# Altium schematic sheet power.SchDoc
size A4; SheetNumber: 3; SheetTotal: 4
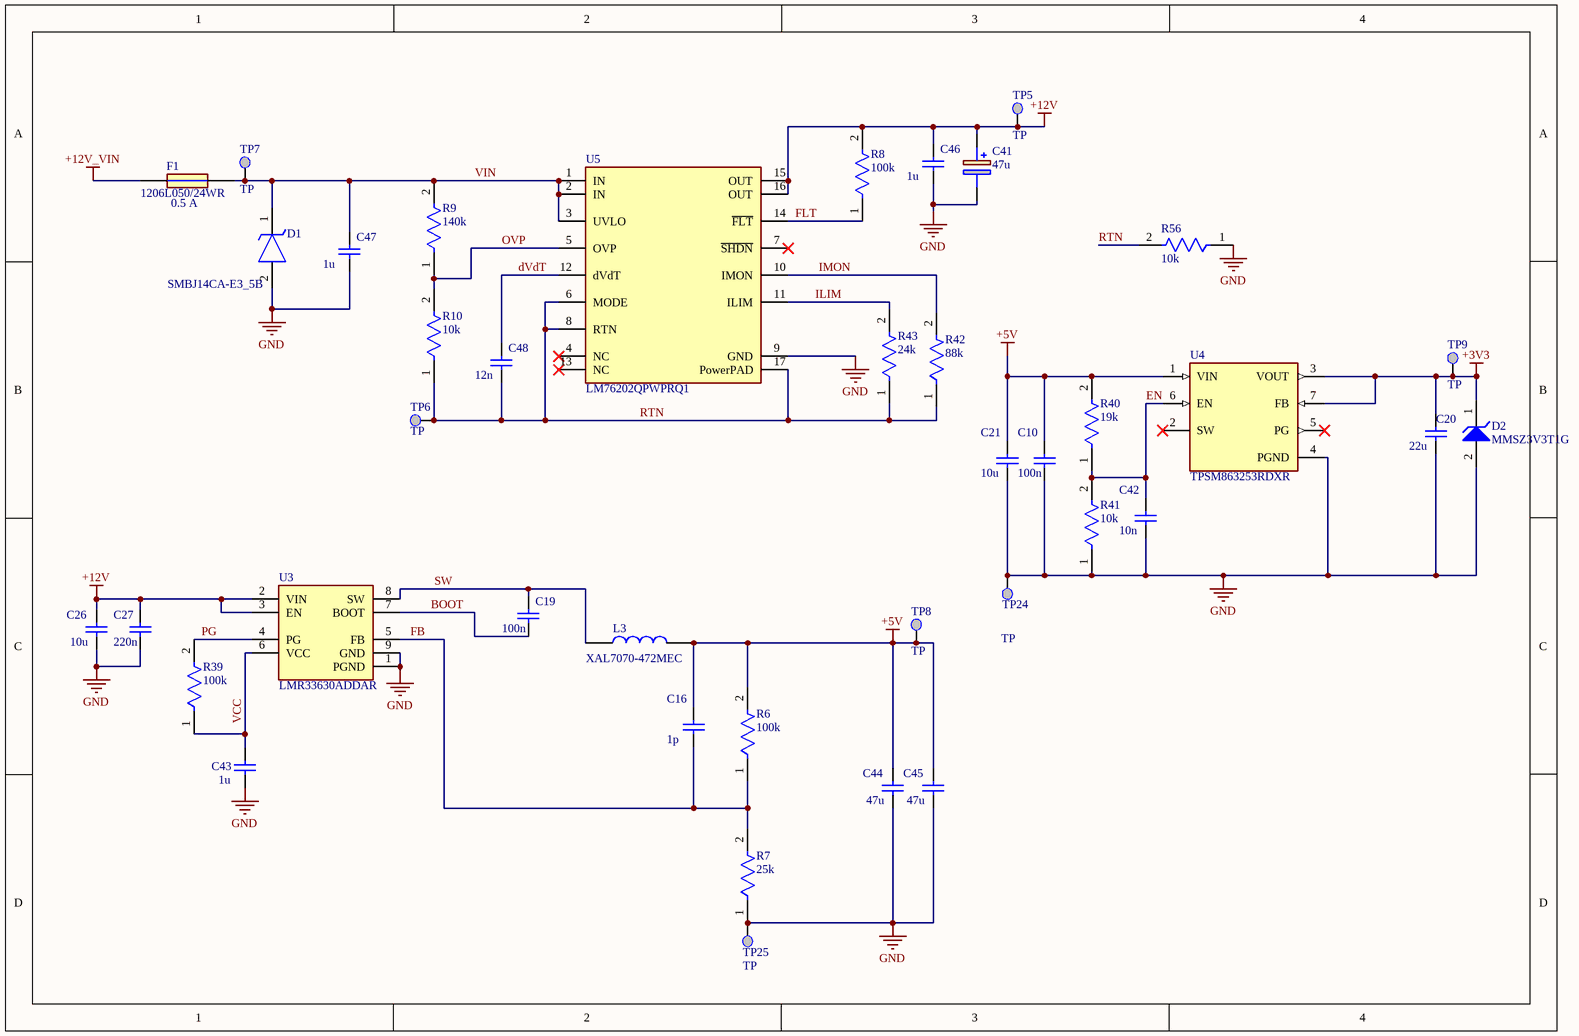
[diagram p0: power.SchDoc]

## Parts
C10  100n  [CAPC1206(3216)150_L]
C16  1p  [CAPC1206(3216)150_L]
C19  100n  [CAPC1206(3216)150_L]
C20  22u  [CAPC1206(3216)150_L]
C21  10u  [CAPC1206(3216)150_L]
C26  10u  [CAPC1206(3216)150_L]
C27  220n  [CAPC1206(3216)150_L]
C41  47u  [EDK476M035S9GAA]
C42  10n  [CAPC1206(3216)150_L]
C43  1u  [CAPC1206(3216)150_L]
C44  47u  [CAPC1206(3216)150_L]
C45  47u  [CAPC1206(3216)150_L]
C46  1u  [CAPC1206(3216)150_L]
C47  1u  [CAPC1206(3216)150_L]
C48  12n  [CAPC1206(3216)150_L]
D1  SMBJ14CA-E3_5B  [SMBJ13A-E3_5B]
D2  MMSZ3V3T1G  [ONSC-SOD-123-2-425-04_V]
F1  1206L050/24WR  [0ZCJ0025FF2E]
L3  XAL7070-472MEC  [XAL7070472MEC]
R6  100k  [FP-RK73H2B-MFG]
R7  25k  [FP-RK73H2B-MFG]
R8  100k  [FP-RK73H2B-MFG]
R9  140k  [FP-RK73H2B-MFG]
R10  10k  [FP-RK73H2B-MFG]
R39  100k  [FP-RK73H2B-MFG]
R40  19k  [FP-RK73H2B-MFG]
R41  10k  [FP-RK73H2B-MFG]
R42  88k  [FP-RK73H2B-MFG]
R43  24k  [FP-RK73H2B-MFG]
R56  10k  [FP-RK73H2B-MFG]
TP5  TP  [Test_Point]
TP6  TP  [Test_Point]
TP7  TP  [Test_Point]
TP8  TP  [Test_Point]
TP9  TP  [Test_Point]
TP24  TP  [Test_Point]
TP25  TP  [Test_Point]
U3  LMR33630ADDAR  [LMR33630ADDAR]
U4  TPSM863253RDXR  [TPSM863253RDXR]
U5  LM76202QPWPRQ1  [FP-PWP0016H-MFG]

## Nets
+3V3: C20.1 D2.1(K) TP9.1 U4.3(VOUT) U4.7(FB)
+5V: C10.1 C16.1 C21.1 C44.1 C45.1 L3.2 R6.2 R40.2 TP8.1 U4.1(VIN)
+12V: C26.1 C27.1 C41.1(+) C46.1 R8.2 TP5.1 U3.2(VIN) U3.3(EN) U5.15(OUT) U5.16(OUT)
+12V_VIN: F1.1
GND: C10.2 C20.2 C21.2 C26.2 C27.2 C41.2(-) C42.2 C43.2 C44.2 C45.2 C46.2 C47.2 D1.2(A) D2.2(A) R7.1 R41.1 R56.1 TP24.1 TP25.1 U3.1(PGND) U3.9(GND) U4.4(PGND) U5.9(GND)
BOOT: C19.2 U3.7(BOOT)
dVdT: C48.1 U5.12(dVdT)
EN: C42.1 R40.1 R41.2 U4.6(EN)
FB: C16.2 R6.1 R7.2 U3.5(FB)
FLT: R8.1 U5.14(~{FLT})
ILIM: R43.2 U5.11(ILIM)
IMON: R42.2 U5.10(IMON)
OVP: R9.1 R10.2 U5.5(OVP)
PG: R39.2 U3.4(PG)
RTN: C48.2 R10.1 R42.1 R43.1 R56.2 TP6.1 U5.6(MODE) U5.8(RTN) U5.17(PowerPAD)
SW: C19.1 L3.1 U3.8(SW)
VCC: C43.1 R39.1 U3.6(VCC)
VIN: C47.1 D1.1(K) F1.2 R9.2 TP7.1 U5.1(IN) U5.2(IN) U5.3(UVLO)

Not connected (* = marked no-connect by the designer): U4 2(SW)* 5(PG)*; U5 4(NC)* 7(~{SHDN})* 13(NC)*

## Notes on the sheet
- (near F1) 0.5 A

## Library data of the parts
C10 C16 C19-C21 C26 C27 C42-C48 = CMP-1037-04778-1: CAP 1.8uF 10V ±5% 1206 (3216 Metric) Thickness 1.45mm SMD; Case-EIA: 1206; Tolerance: Â±5%; Case-Metric: 3216; Technology: SMT; Value: 1.8uF; Rated Voltage: 10 V; Max Thickness: 1.45 mm
C41 = EDK476M035S9GAA: Surface Mount, Aluminum Electrolytic; Manufacturer_Name: Yageo Group; Geometry.Height: 5.65mm; Manufacturer_Part_Number: EDK476M035S9GAA; Mouser Part Number: 80-EDK476M035S9GAA; Mouser Price/Stock: https://www.mouser.co.uk/ProductDetail/KEMET/EDK476M035S9GAA?qs=T9vdlufmP8xkQWuUhcj0Kg%3D%3D; Arrow Part Number: EDK476M035S9GAA; Arrow Price/Stock: https://www.arrow.com/en/products/edk476m035s9gaa/kemet-corporation?utm_currency=USD&region=nac; Datasheet Link: https://www.yageogroup.com/content/datasheet/asset/file/KEM_A4001_EDK
D1 = SMBJ13A-E3_5B: TVS Diode (Uni-directional); Manufacturer_Name: Vishay; Manufacturer_Part_Number: SMBJ13A-E3/5B; Datasheet Link: http://www.vishay.com/docs/88392/smbj.pdf; Height: 2.44mm; Mouser Part Number: 625-SMBJ13A-E3/5B; Mouser Price/Stock: https://www.mouser.co.uk/ProductDetail/Vishay-General-Semiconductor/SMBJ13A-E3-5B?qs=3qLEwsAJF5SlimqtZxBirg%3D%3D; Arrow Part Number: SMBJ13A-E3/5B; Arrow Price/Stock: https://www.arrow.com/en/products/smbj13a-e35b/vishay?utm_currency=USD&region=europe
D2 = CMP-1060-00515-1: Zener Voltage Regulator, 500 mW, 2-Pin SOD-123, Pb-Free, Tape and Reel; Manufacturer: On Semiconductor; P Max (W): 0.5; ComponentLink3URL: http://www.onsemi.com/pub_link/Collateral/425-04.PDF; ComponentLink2Description: Datasheet; DatasheetVersion: Rev. 11; ComponentLink1URL: http://www.onsemi.com/; PackageDescription: 2-Pin SOD, Body 1.6 x 2.69 mm; Mounting Technology: Surface Mount; ComponentLink3Description: Package Specification; ComponentLink1Description: Manufacturer URL; Packing: Tape and Reel; ComponentLink2URL: http://www.onsemi.com/pub_link/Collateral/MMSZ2V4T1-D.PDF; PartNumber: MMSZ3V3T1G; PackageReference: SOD-123-2-425-04; PackageVersion: Rev. G, 10/2009; RoHS: Pb-Free
F1 = 0ZCJ0025FF2E: BEL FUSE - CIRCUIT PROTECTION - 0ZCJ0025FF2E - FUSE, RESETTABLE PTC, 16VDC, 0.25A, SMD; Manufacturer_Name: Bel Circuit Protection; Geometry.Height: 0.75mm; Mouser Part Number: *; Mouser Price/Stock: *; Manufacturer_Part_Number: 0ZCJ0025FF2E; Datasheet Link: https://componentsearchengine.com/Datasheets/2/0ZCJ0025FF2E.pdf
L3 = XAL7070-472MEC: General Purpose Inductor, 4.7uH, 20%, 1 Element, Composite-Core, SMD, 3028; Manufacturer_Name: COILCRAFT; Geometry.Height: 7mm; DC Resistance (DCR): 14.26mΩ; Value: 4.7µH; Max Current Rating: 13.6A; Number of Circuits: 1; Saturation Current: 15.2A; Self Resonant Frequency: 26MHz; Shielding: Yes; Test Frequency: 1MHz; Mouser Part Number: 994-XAL7070-472MEC; Mouser Price/Stock: https://www.mouser.co.uk/ProductDetail/Coilcraft/XAL7070-472MEC?qs=zCSbvcPd3pZar3i%2F4%252BSjWg%3D%3D; Manufacturer_Part_Number: XAL7070-472MEC; Datasheet Link: https://www.coilcraft.com/pdfs/xal7070.pdf; Supplier: Farnell; Supplier Part Number: 2289129; Manufacturer: Coilcraft; Manufacturer Part Number: XAL7070-472MEC; RoHS: Compliant; Category: Fixed Inductors; Stock: 742; Ambient Temperature Range High: 125°C; Case/Package: SMD/SMT; Core Material: Composite; Height: 7mm; Inductance Tolerance: 20%; Lead Free: Contains Lead; Length: 8mm; Lifecycle Status: Production; Max DC Current: 13.6A; Max Operating Temperature: 125°C; Min Operating Temperature: -40°C; Mounting Technology: Surface Mount; Number of Terminals: 2; Packaging: Cut Tape; REACH SVHC: Yes; RMS Current (Irms): 13.6A; ESR: 14.26mΩ; Termination: SMD/SMT; Tolerance: 20%; Width: 7.2mm; ComponentLink1URL: https://datasheet.octopart.com:443/XAL7070-472MEC-Coilcraft-datasheet-180122068.pdf?src-supplier=IHS; ComponentLink1Description: https://datasheet.octopart.com:443/XAL7070-472MEC-Coilcraft-datasheet-180122068.pdf?src-supplier=IHS; ComponentLink2URL: https://datasheet.octopart.com:443/XAL7070-472MEC-Coilcraft-datasheet-10791984.pdf?src-supplier=Coilcraft+Direct; ComponentLink2Description: https://datasheet.octopart.com:443/XAL7070-472MEC-Coilcraft-datasheet-10791984.pdf?src-supplier=Coilcraft+Direct; ComponentLink3URL: https://datasheet.octopart.com:443/XAL7070-472MEC-Coilcraft-datasheet-181955335.pdf?src-supplier=Newark; ComponentLink3Description: https://datasheet.octopart.com:443/XAL7070-472MEC-Coilcraft-datasheet-181955335.pdf?src-supplier=Newark; ComponentLink4URL: https://datasheet.octopart.com:443/XAL7070-472MEC-Coilcraft-datasheet-14354386.pdf?src-supplier=Newark; ComponentLink4Description: https://datasheet.octopart.com:443/XAL7070-472MEC-Coilcraft-datasheet-14354386.pdf?src-supplier=Newark
R6-R10 R39-R43 R56 = CMP-04015-098385-1: 40.2kΩ ±1% 0.25W Chip Resistor 1206 Thick Film AEC-Q200 Qualified; Resistance: 40.2kR; Voltage Rating (DC): 200V; Temperature Coefficient: 100ppm/°C; Power Rating: 250mW; Tolerance: 1%; Package Quantity: 5000; Length: 3.2mm; Termination: SMD/SMT; Lead Free: Contains Lead; Case Code (Imperial): 1206; Case/Package: 1206; Voltage Rating: 200V; Case Code (Metric): 3216; Max Operating Temperature: 155°C; Packaging: Tape and Reel; Width: 1.6mm; Series: RK73H; Min Operating Temperature: -55°C; RoHS Compliant: No; Height: 0.6mm
TP5-TP9 TP24 TP25 = TestPoint
U3 = LMR33630ADDAR: SIMPLE SWITCHER® 3.8V to 36V, 3A Synchronous Buck Converter With Ultra-Low EMI 8-SO PowerPAD -40 to 125; Manufacturer_Name: Texas Instruments; Manufacturer Lifecycle Status: ACTIVE; Geometry.Height: 1.7mm; Max Duty Cycle: 98%; Max Junction Temperature (Tj): 150°C; Nominal Supply Current: 24µA; Number of Channels: 1; Switching Frequency: 400kHz; Manufacturer_Part_Number: LMR33630ADDAR; Mouser Part Number: 595-LMR33630ADDAR; Mouser Price/Stock: https://www.mouser.co.uk/ProductDetail/Texas-Instruments/LMR33630ADDAR?qs=r5DSvlrkXmJQkBTqgVdiDA%3D%3D; Arrow Part Number: LMR33630ADDAR; Arrow Price/Stock: https://www.arrow.com/en/products/lmr33630addar/texas-instruments?utm_currency=USD&region=nac; Datasheet Link: http://www.ti.com/lit/gpn/lmr33630; Supplier: DigiKey; Supplier Part Number: 296-49763-1-ND; Manufacturer: Texas Instruments; Manufacturer Part Number: LMR33630ADDAR; RoHS: Compliant; Category: Voltage Regulators - Switching; Stock: 3306; Pricing: 1=2,55, 10=1,895, 25=1,732, 100=1,5527, 250=1,4672, 500=1,41566, 1000=1,37324 (USD); Height: 1.7mm; Length: 4.89mm; Lifecycle Status: Production; Max Operating Temperature: 125°C; Max Supply Voltage: 36V; Min Operating Temperature: -40°C; Min Supply Voltage: 3.8V; Number of Outputs: 1; Pins: 8; Output Current: 3A; Schedule B: 8542390000; Thickness: 1.48mm; Topology: Buck; Width: 3.9mm; ComponentLink1URL: https://octopart.com:443/opatz8j6/c1?t=vB-rOmDI1ErJ0w3fCj8NLsfgClszgTUVbAqCYHM5mRqgzR9RBB5Pla--LZzs2g-5lBj7oDBEHLOY0DNQ8kiPC6C8g1CaFcIk5xusZs0FtDRH-CQ1FAZX0wQ7Af0vopd1OvNJ_Hrieycu-9D8HxSeoZovH4OJEcn7j74SeItdt-lCJsWpQWgV8-mVR1JIQ1KywJKCZ68bDiAWG91PubKPct48upMq1AnCkLHjDL3bhpicF0q3kjtxBAWzeDQzkpoQooz9GAvObiI6PlzZfk112pcCDh0P81IWp_Rr5acb26OlKDk2j5b40au3vy2C1-LFGDaZycRESUfyv9lqHnr9FsK7A0AJECnAAloOYp_c-_g9Mk5jVvAjSOs1Y_7rtCi9vouLs8vl&src-supplier=Texas+Instruments; ComponentLink1Description: https://octopart.com:443/opatz8j6/c1?t=vB-rOmDI1ErJ0w3fCj8NLsfgClszgTUVbAqCYHM5mRqgzR9RBB5Pla--LZzs2g-5lBj7oDBEHLOY0DNQ8kiPC6C8g1CaFcIk5xusZs0FtDRH-CQ1FAZX0wQ7Af0vopd1OvNJ_Hrieycu-9D8HxSeoZovH4OJEcn7j74SeItdt-lCJsWpQWgV8-mVR1JIQ1KywJKCZ68bDiAWG91PubKPct48upMq1AnCkLHjDL3bhpicF0q3kjtxBAWzeDQzkpoQooz9GAvObiI6PlzZfk112pcCDh0P81IWp_Rr5acb26OlKDk2j5b40au3vy2C1-LFGDaZycRESUfyv9lqHnr9FsK7A0AJECnAAloOYp_c-_g9Mk5jVvAjSOs1Y_7rtCi9vouLs8vl&src-supplier=Texas+Instruments; ComponentLink2URL: https://sigma.octopart.com:443/104526336/technical_drawing/Texas-Instruments-LMR33630ADDAR.pdf?src-supplier=Texas+Instruments; ComponentLink2Description: https://sigma.octopart.com:443/104526336/technical_drawing/Texas-Instruments-LMR33630ADDAR.pdf?src-supplier=Texas+Instruments; ComponentLink3URL: https://sigma.octopart.com:443/49250132/technical_drawing/Texas-Instruments-LMR33630ADDAR.pdf?src-supplier=Texas+Instruments; ComponentLink3Description: https://sigma.octopart.com:443/49250132/technical_drawing/Texas-Instruments-LMR33630ADDAR.pdf?src-supplier=Texas+Instruments; ComponentLink4URL: https://datasheet.octopart.com:443/LMR33630ADDAR-Texas-Instruments-datasheet-148393519.pdf?src-supplier=Upverter; ComponentLink4Description: https://datasheet.octopart.com:443/LMR33630ADDAR-Texas-Instruments-datasheet-148393519.pdf?src-supplier=Upverter; ComponentLink5URL: https://datasheet.octopart.com:443/LMR33630ADDAR-Texas-Instruments-datasheet-163730535.pdf?src-supplier=LCSC; ComponentLink5Description: https://datasheet.octopart.com:443/LMR33630ADDAR-Texas-Instruments-datasheet-163730535.pdf?src-supplier=LCSC; ComponentLink6URL: http://sigma.octopart.com:80/reach_statement/Texas-Instruments-company-64.pdf?src-supplier=Compliance+Statements; ComponentLink6Description: http://sigma.octopart.com:80/reach_statement/Texas-Instruments-company-64.pdf?src-supplier=Compliance+Statements; ComponentLink7URL: http://sigma.octopart.com:80/conflict_mineral_statement/Texas-Instruments-company-63.pdf?src-supplier=Compliance+Statements; ComponentLink7Description: http://sigma.octopart.com:80/conflict_mineral_statement/Texas-Instruments-company-63.pdf?src-supplier=Compliance+Statements
U4 = TPSM863253RDXR: 3V to 17V input voltage, 3.3V, 3A output synchronous buck module in QFN package 7-QFN-FCMOD -40 to 125; Manufacturer Lifecycle Status: ACTIVE; MF: Texas Instruments; SnapEDA_Link: https://www.snapeda.com/parts/TPSM863253RDXR/Texas+Instruments/view-part/?ref=snap; Package: None; Value: *; MP: TPSM863253RDXR; Check_prices: https://www.snapeda.com/parts/TPSM863253RDXR/Texas+Instruments/view-part/?ref=eda; Supplier: DigiKey; Supplier Part Number: 296-TPSM863253RDXRCT-ND; Manufacturer: Texas Instruments; Manufacturer Part Number: TPSM863253RDXR; RoHS: Compliant; Category: Integrated Circuits (ICs); Stock: 3257; Pricing: 1=2,63, 10=1,96, 25=1,7924, 100=1,6078, 250=1,51976, 500=1,46668, 1000=1,42301 (USD); Height: 0m; Length: 4mm; Lifecycle Status: Production; Pins: 7; Thickness: 2mm; Width: 3.3mm; ComponentLink1URL: https://octopart.com:443/opatz8j6/c1?t=jS2VDNp59x-r3M4UnJwIkxDyXkbjHNSAoP2Fns5-Wk80kLlb-mQ5gVuk8zyi84j77RuBrZF-262aE3noOfDKcDGPEWkV9DoDQewFCLFFRyInceCxvVyAfhTYCYIywjkPWDqBy3YcbHQILjtWA_Eaj3WAHosXV5eHD7vpZYJjVrSO88bXdsuSYdlpSx9vUfFmQgFuFA-HMfKLGSBXL49TLOzJ5T2tngLQpQw-KF5iF-olhgVCegbBT0_kXe8-zNmOJ90ZL3AMoFtxFgWXTiA3kg8TbPVDzmO9NJcakYYdjuReFGLrhU-Lh8uurvImosMTR0LFVg6PaXdiPOKNUC1j5THOrz5of0wHKRbirvbX2rJGgWFTmZxbk0I20_VZT7Zu5rI_wToFdFWt&src-supplier=Texas+Instruments; ComponentLink1Description: https://octopart.com:443/opatz8j6/c1?t=jS2VDNp59x-r3M4UnJwIkxDyXkbjHNSAoP2Fns5-Wk80kLlb-mQ5gVuk8zyi84j77RuBrZF-262aE3noOfDKcDGPEWkV9DoDQewFCLFFRyInceCxvVyAfhTYCYIywjkPWDqBy3YcbHQILjtWA_Eaj3WAHosXV5eHD7vpZYJjVrSO88bXdsuSYdlpSx9vUfFmQgFuFA-HMfKLGSBXL49TLOzJ5T2tngLQpQw-KF5iF-olhgVCegbBT0_kXe8-zNmOJ90ZL3AMoFtxFgWXTiA3kg8TbPVDzmO9NJcakYYdjuReFGLrhU-Lh8uurvImosMTR0LFVg6PaXdiPOKNUC1j5THOrz5of0wHKRbirvbX2rJGgWFTmZxbk0I20_VZT7Zu5rI_wToFdFWt&src-supplier=Texas+Instruments; ComponentLink2URL: https://datasheet.octopart.com:443/TPSM863253RDXR-Texas-Instruments-datasheet-184174687.pdf?src-supplier=LCSC; ComponentLink2Description: https://datasheet.octopart.com:443/TPSM863253RDXR-Texas-Instruments-datasheet-184174687.pdf?src-supplier=LCSC; ComponentLink3URL: http://sigma.octopart.com:80/reach_statement/Texas-Instruments-company-64.pdf?src-supplier=Compliance+Statements; ComponentLink3Description: http://sigma.octopart.com:80/reach_statement/Texas-Instruments-company-64.pdf?src-supplier=Compliance+Statements; ComponentLink4URL: http://sigma.octopart.com:80/conflict_mineral_statement/Texas-Instruments-company-63.pdf?src-supplier=Compliance+Statements; ComponentLink4Description: http://sigma.octopart.com:80/conflict_mineral_statement/Texas-Instruments-company-63.pdf?src-supplier=Compliance+Statements
U5 = CMP-04910-000034-1: IC POWER MANAGEMENT